# Altium schematic sheet Power_2.SchDoc
size A4; Organization: Altium Limited; Address1: L3, 12a Rodborough Rd; Address2: Frenchs Forest; Address3: NSW; Address4: Australia 2086
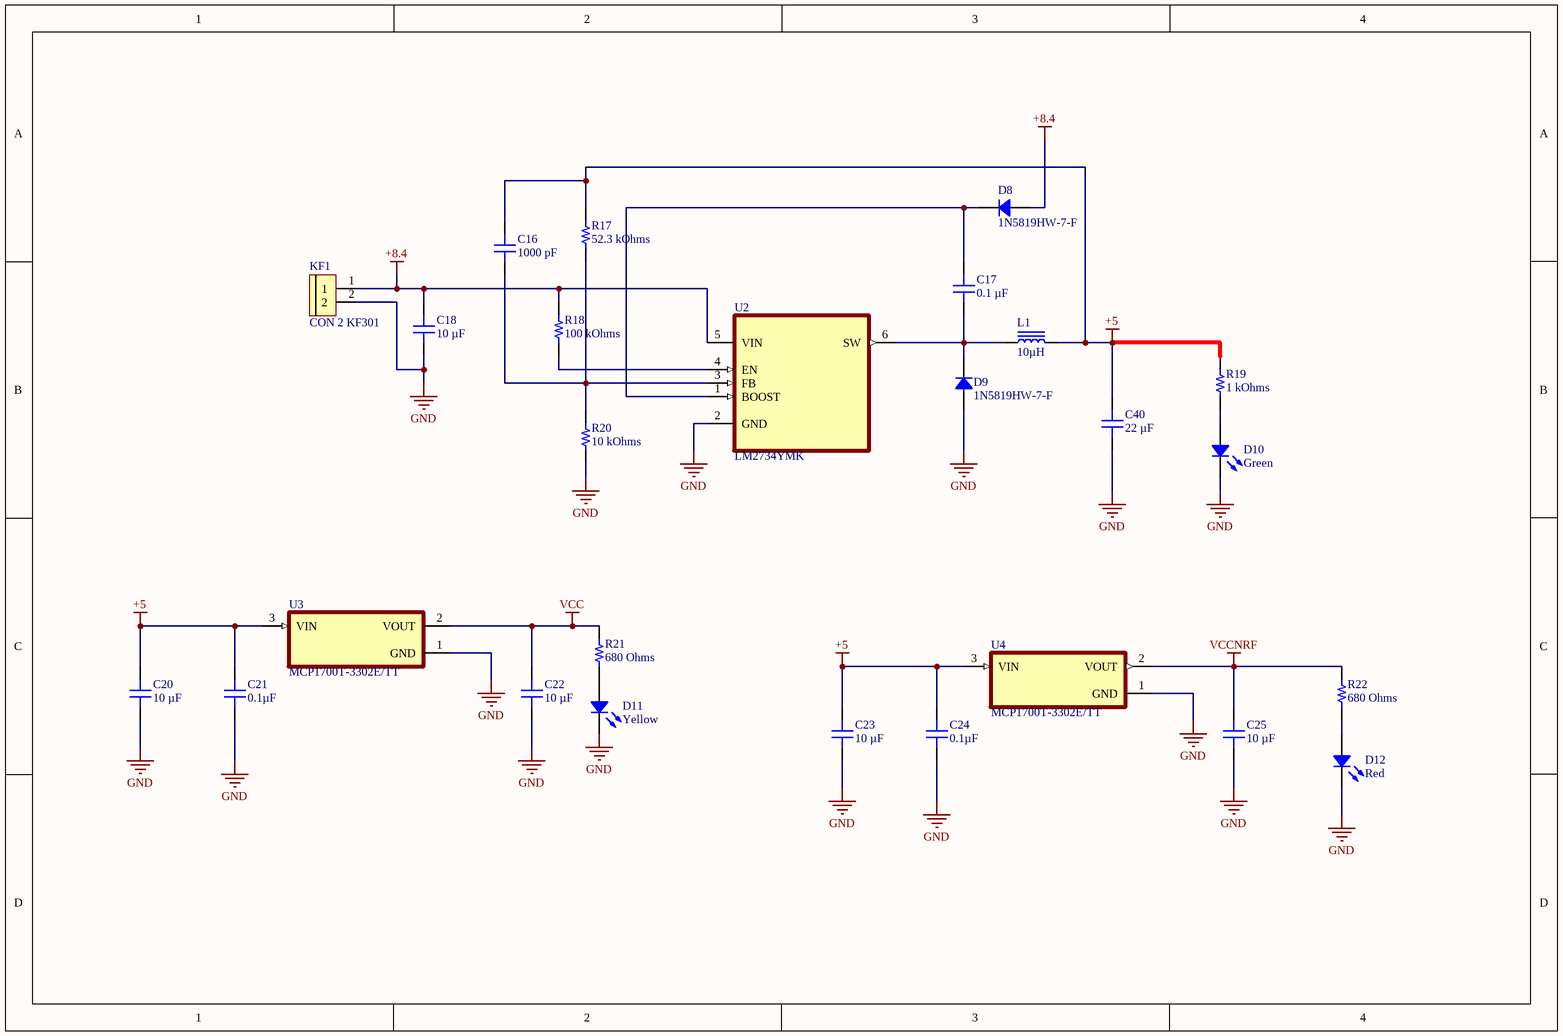
[diagram p0: Power_2.SchDoc]

## Parts
C16  1000 pF  [CAP 0603_1608]
C17  0.1 µF  [CAP 0603_1608]
C18  10 µF  [CAP 0805_2012]
C20  10 µF  [CAP 0805_2012]
C21  0.1µF  [CAP 0603_1608]
C22  10 µF  [CAP 0603_1608]
C23  10 µF  [CAP 0805_2012]
C24  0.1µF  [CAP 0603_1608]
C25  10 µF  [CAP 0603_1608]
C40  22 µF  [CAP 0805_2012]
D8  1N5819HW-7-F  [SOD-123]
D9  1N5819HW-7-F  [SOD-123]
D10  Green  [LED 0603_1608 GREEN]
D11  Yellow  [LED 0603_1608 YELLOW]
D12  Red  [LED 0603_1608 RED]
KF1  CON 2 KF301  [Con 2 KF301 5.08]
L1  10µH  [TDK SLF7032]
R17  52.3 kOhms  [RES 0603_1608]
R18  100 kOhms  [RES 0603_1608]
R19  1 kOhms  [RES 0603_1608]
R20  10 kOhms  [RES 0603_1608]
R21  680 Ohms  [RES 0603_1608]
R22  680 Ohms  [RES 0603_1608]
U2  LM2734YMK  [SOT95P285X100-6N]
U3  MCP1700T-3302E/TT  [SOT95P237X112-3N]
U4  MCP1700T-3302E/TT  [SOT95P237X112-3N]

## Nets
+5: C16.2 C20.2 C21.2 C23.2 C24.2 C40.2 L1.2 R17.2 R19.2 U3.3(VIN) U4.3(VIN)
+8.4: C18.2 D8.1 KF1.1 R18.2 U2.5(VIN)
GND: C18.1 C20.1 C21.1 C22.1 C23.1 C24.1 C25.1 C40.1 D9.1 D10.2 D11.2 D12.2 KF1.2 R20.1 U2.2(GND) U3.1(GND) U4.1(GND)
VCC: C22.2 R21.2 U3.2(VOUT)
VCCNRF: C25.2 R22.2 U4.2(VOUT)
NetC16_1: C16.1 R17.1 R20.2 U2.3(FB)
NetC17_1: C17.1 D9.2 L1.1 U2.6(SW)
NetC17_2: C17.2 D8.2 U2.1(BOOST)
NetD10_1: D10.1 R19.1
NetD11_1: D11.1 R21.1
NetD12_1: D12.1 R22.1
NetR18_1: R18.1 U2.4(EN)

## Notes on the sheet
- Title
- Size:
- Date:
- A4
- Number:
- Time:
- Revision:
- Sheet
- of
- File:

## Library data of the parts
C16 = VJ0603Y102KXQCW1BC: CAP CER 1000PF 10V X7R 0603; manufacturer: Vishay Vitramon; Tolerance: ±10%; Part Number: VJ0603Y102KXQCW1BC; Value: 1000 pF; Applications: General Purpose; Capacitance: 1000 pF; componentlink1description: Datasheet; componentlink1url: https://www.vishay.com/docs/28548/vjw1bcbascomseries.pdf; componentlink2description: DigiKey Link; componentlink2url: https://www.digikey.com/en/products/detail/vishay-vitramon/VJ0603Y102KXQCW1BC/8305229; Device Package: 0603 (1608 Metric); lastupdated: 2/9/2024 8:10:13 PM; Lifecycle Status: Active; Minimum Order: 1; Mounting Type: Surface Mount, MLCC; Operating Temperature: -55°C ~ 125°C; Package / Case: 0603 (1608 Metric); packaging: TapeAndReel; partid: 14875; Part Status: Active; price: 0.01; series: VJ W1BC; Size / Dimension: 0.063" L x 0.031" W (1.60mm x 0.80mm); Supplier 1: DigiKey; Supplier Part Number 1: 720-1679-1-ND; Temperature Coefficient: X7R; Thickness (Max): 0.034" (0.87mm); Voltage - Rated: 10V
C17 = CX0603MRX7R6BB104: CAP CER 0.1UF 10V X7R 0603; manufacturer: PulseLarsen Antennas; Tolerance: ±20%; Part Number: CX0603MRX7R6BB104; Value: 0.1 µF; Applications: Bypass, Decoupling; Capacitance: 0.1 µF; componentlink1description: Datasheet; componentlink1url: https://productfinder.pulseelectronics.com/api/open/product-attachments/datasheet/cx0805mrx7r0bb102; componentlink2description: DigiKey Link; componentlink2url: https://www.digikey.com/en/products/detail/pulselarsen-antennas/CX0603MRX7R6BB104/1219074; Device Package: 0603 (1608 Metric); Features: Low ESL (X2Y); lastupdated: 2/9/2024 8:09:55 PM; Lifecycle Status: Active; Minimum Order: 1; Mounting Type: Surface Mount, MLCC; Operating Temperature: -55°C ~ 125°C; Package / Case: 0603 (1608 Metric); packaging: TapeAndReel; partid: 34696; Part Status: Active; price: 0.09; series: X2Y®; Size / Dimension: 0.063" L x 0.033" W (1.60mm x 0.85mm); Supplier 1: DigiKey; Supplier Part Number 1: 311-1237-1-ND; Temperature Coefficient: X7R; Thickness (Max): 0.030" (0.75mm); Voltage - Rated: 10V
C18 = CL21A106KOQNNWE: CAP CER 10UF 16V X5R 0805; manufacturer: Samsung Electro-Mechanics; Tolerance: ±10%; Part Number: CL21A106KOQNNWE; Value: 10 µF; Applications: General Purpose; Capacitance: 10 µF; componentlink1description: Datasheet; componentlink1url: http://www.samsungsem.com/kr/support/product-search/mlcc/CL21A106KOQNNWE.jsp; componentlink2description: DigiKey Link; componentlink2url: https://www.digikey.com/en/products/detail/samsung-electro-mechanics/CL21A106KOQNNWE/3888552; Device Package: 0805 (2012 Metric); lastupdated: 2/9/2024 8:15:45 PM; Lifecycle Status: Active; Minimum Order: 1; Mounting Type: Surface Mount, MLCC; Operating Temperature: -55°C ~ 85°C; Package / Case: 0805 (2012 Metric); packaging: TapeAndReel; partid: 11753; Part Status: Active; price: 0.02; series: CL; Size / Dimension: 0.079" L x 0.049" W (2.00mm x 1.25mm); Supplier 1: DigiKey; Supplier Part Number 1: 1276-2894-1-ND; Temperature Coefficient: X5R; Thickness (Max): 0.055" (1.40mm); Voltage - Rated: 16V
C20 C23 = CL21A106KOQNNNG: CAP CER 10UF 16V X5R 0805; manufacturer: Samsung Electro-Mechanics; Tolerance: ±10%; Part Number: CL21A106KOQNNNG; Value: 10 µF; Applications: General Purpose; Capacitance: 10 µF; componentlink1description: Datasheet; componentlink1url: http://www.samsungsem.com/kr/support/product-search/mlcc/CL21A106KOQNNNG.jsp; componentlink2description: DigiKey Link; componentlink2url: https://www.digikey.com/en/products/detail/samsung-electro-mechanics/CL21A106KOQNNNG/3894417; Device Package: 0805 (2012 Metric); lastupdated: 2/9/2024 8:15:59 PM; Lifecycle Status: Active; Minimum Order: 1; Mounting Type: Surface Mount, MLCC; Operating Temperature: -55°C ~ 85°C; Package / Case: 0805 (2012 Metric); packaging: TapeAndReel; partid: 39874; Part Status: Active; price: 0.01; series: CL; Size / Dimension: 0.079" L x 0.049" W (2.00mm x 1.25mm); Supplier 1: DigiKey; Supplier Part Number 1: 1276-6455-1-ND; Temperature Coefficient: X5R; Thickness (Max): 0.055" (1.40mm); Voltage - Rated: 16V
C21 = LD03ZC104KAB2A: CAP CER 0.1UF 10V X7R 0603; manufacturer: AVX Corporation; Tolerance: ±10%; Part Number: LD03ZC104KAB2A; Value: 0.1µF; Applications: General Purpose; Capacitance: 0.1µF; componentlink1description: Datasheet; componentlink1url: http://datasheets.avx.com/LD-Series.pdf; componentlink2description: DigiKey Link; componentlink2url: http://digikey.com/product-detail/en/avx-corporation/LD03ZC104KAB2A/478-12926-1-ND/9949296; Device Package: 0603 (1608 Metric); lastupdated: 9/2/2020 1:03:06 AM; Lifecycle Status: Active; Minimum Order: 1; Mounting Type: Surface Mount, MLCC; Operating Temperature: -55°C ~ 125°C; Package / Case: 0603 (1608 Metric); packaging: TapeAndReel; partid: 16481; Part Status: Active; price: 0.17; series: LD; Size / Dimension: 0.063" L x 0.032" W (1.60mm x 0.81mm); Supplier 1: DigiKey; Supplier Part Number 1: 478-12926-1-ND; Temperature Coefficient: X7R; Thickness (Max): 0.035" (0.90mm); Voltage - Rated: 10V
C22 C25 = KGM15CS61A106MT: CAP CER 10UF 10V X6S 0603; manufacturer: KYOCERA AVX; Tolerance: ±20%; Part Number: KGM15CS61A106MT; Value: 10 µF; Applications: General Purpose; Capacitance: 10 µF; componentlink1description: Datasheet; componentlink1url: https://ele.kyocera.com/assets/products/capacitor/CM_Series_e.pdf; componentlink2description: DigiKey Link; componentlink2url: https://www.digikey.com/en/products/detail/kyocera-avx/KGM15CS61A106MT/12397342; Device Package: 0603 (1608 Metric); lastupdated: 2/9/2024 8:09:23 PM; Lifecycle Status: Active; Minimum Order: 1; Mounting Type: Surface Mount, MLCC; Operating Temperature: -55°C ~ 105°C; Package / Case: 0603 (1608 Metric); packaging: TapeAndReel; partid: 51317; Part Status: Active; price: 0.04; series: KGM - X6S; Size / Dimension: 0.063" L x 0.031" W (1.60mm x 0.80mm); Supplier 1: DigiKey; Supplier Part Number 1: 478-KGM15CS61A106MTCT-ND; Temperature Coefficient: X6S; Thickness (Max): 0.039" (1.00mm); Voltage - Rated: 10V
C24 = 0603YC104JAZ2A: CAP CER 0.1UF 16V X7R 0603; manufacturer: AVX Corporation; Tolerance: ±5%; Part Number: 0603YC104JAZ2A; Value: 0.1µF; Applications: Boardflex Sensitive; Capacitance: 0.1µF; componentlink1description: Datasheet; componentlink1url: http://datasheets.avx.com/FlexitermMLCC.pdf; componentlink2description: DigiKey Link; componentlink2url: http://digikey.com/product-detail/en/avx-corporation/0603YC104JAZ2A/478-5291-1-ND/1950958; Device Package: 0603 (1608 Metric); Features: Soft Termination; lastupdated: 9/2/2020 1:03:16 AM; Lifecycle Status: Active; Minimum Order: 1; Mounting Type: Surface Mount, MLCC; Operating Temperature: -55°C ~ 125°C; Package / Case: 0603 (1608 Metric); packaging: TapeAndReel; partid: 13201; Part Status: Active; price: 0.11; series: FLEXITERM®; Size / Dimension: 0.063" L x 0.032" W (1.60mm x 0.81mm); Supplier 1: DigiKey; Supplier Part Number 1: 478-5291-1-ND; Temperature Coefficient: X7R; Thickness (Max): 0.035" (0.90mm); Voltage - Rated: 16V
C40 = C2012X5R1A226M125AE: CAP CER 22UF 10V X5R 0805; manufacturer: TDK Corporation; Tolerance: ±20%; Part Number: C2012X5R1A226M125AE; Value: 22 µF; Applications: Boardflex Sensitive; Capacitance: 22 µF; componentlink1description: Datasheet; componentlink1url: https://product.tdk.com/info/en/catalog/datasheets/mlcc_commercial_soft_en.pdf?ref_disty=digikey; componentlink2description: DigiKey Link; componentlink2url: https://www.digikey.com/en/products/detail/tdk-corporation/C2012X5R1A226M125AE/9991384; Device Package: 0805 (2012 Metric); Features: Soft Termination; lastupdated: 2/9/2024 8:15:35 PM; Lifecycle Status: Active; Minimum Order: 1; Mounting Type: Surface Mount, MLCC; Operating Temperature: -55°C ~ 85°C; Package / Case: 0805 (2012 Metric); packaging: TapeAndReel; partid: 39859; Part Status: Active; price: 0.36; series: C; Size / Dimension: 0.079" L x 0.049" W (2.00mm x 1.25mm); Supplier 1: DigiKey; Supplier Part Number 1: 445-C2012X5R1A226M125AECT-ND; Temperature Coefficient: X5R; Thickness (Max): 0.059" (1.50mm); Voltage - Rated: 10V
D8 D9 = 1N5819HW-7-F: DIODE SCHOTTKY 40V 1A SOD123; Manufacturer: Diodes Incorporated; Capacitance @ Vr, F: 60pF @ 4V, 1MHz; Current - Reverse Leakage @ Vr: 1 mA @ 40 V; Speed: Fast Recovery =< 500ns, > 200mA (Io); Voltage - Forward (Vf) (Max) @ If: 450 mV @ 1 A; Part Number: 1N5819HW-7-F; ComponentLink1Description: Datasheet; ComponentLink1URL: https://www.diodes.com/assets/Datasheets/ds30217.pdf; ComponentLink2Description: DigiKey Link; ComponentLink2URL: https://www.digikey.com/en/products/detail/diodes-incorporated/1N5819HW-7-F/814970; Current - Average Rectified (Io): 1A; Diode Type: Schottky; LastUpdated: 6/3/2024 7:54:46 PM; Lifecycle Status: Active; Minimum Order: 1; Mounting Type: Surface Mount; Operating Temperature - Junction: -65°C ~ 125°C; Package / Case: SOD-123; Packaging: TapeAndReel; PartId: 2212; Part Status: Active; Price: 0.05; Series: -; Supplier 1: DigiKey; Supplier Part Number 1: 1N5819HW-FDICT-ND; Supplier Device Package: SOD-123; Voltage - DC Reverse (Vr) (Max): 40 V
D10 = QBLP601-IG: LED GREEN CLEAR 0603 SMD; Manufacturer: QT Brightek (QTB); Configuration: Standard; Current - Test: 20mA; Lens Color: Colorless; Lens Size: 1.10mm x 0.80mm; Lens Style: Rectangle with Flat Top; Millicandela Rating: 450mcd; Viewing Angle: 140°; Voltage - Forward (Vf) (Typ): 3.2V; Wavelength - Dominant: 525nm; Part Number: QBLP601-IG; Color: Green; ComponentLink1Description: Datasheet; ComponentLink1URL: http://www.qt-brightek.com/datasheet/QBLP601_series.pdf; ComponentLink2Description: DigiKey Link; ComponentLink2URL: https://www.digikey.com/en/products/detail/qt-brightek-qtb/QBLP601-IG/4814653; Device Package: 0603 (1608 Metric); Height (Max): 0.60mm; LastUpdated: 6/3/2024 7:58:52 PM; Lens Transparency: Clear; Lifecycle Status: Active; Minimum Order: 1; Mounting Type: Surface Mount; Package / Case: 0603 (1608 Metric); Packaging: TapeAndReel; PartId: 668; Part Status: Active; Price: 0.06; Series: QBLP601; Size / Dimension: 1.60mm L x 0.80mm W; Supplier 1: DigiKey; Supplier Part Number 1: 1516-1055-1-ND; Supplier Device Package: 0603; Value: Green
D11 = VAOL-S6YP4: LED YELLOW CLEAR 0603 SMD; Manufacturer: Visual Communications Company - VCC; Configuration: Standard; Current - Test: 10mA; Lens Color: Colorless; Lens Size: 1.20mm x 0.80mm; Lens Style: Rectangle with Flat Top; Millicandela Rating: 33mcd; Viewing Angle: 120°; Voltage - Forward (Vf) (Typ): 1.9V; Wavelength - Dominant: 591nm; Part Number: VAOL-S6YP4; Color: Yellow; ComponentLink1Description: Datasheet; ComponentLink1URL: http://vcclite.com/_pdf/VAOL-S6YP4-LED-0603-yellow.pdf; ComponentLink2Description: DigiKey Link; ComponentLink2URL: http://digikey.com/product-detail/en/visual-communications-company-vcc/VAOL-S6YP4/VAOL-S6YP4CT-ND/5176154; Device Package: 0603 (1608 Metric); Height (Max): 0.60mm; LastUpdated: 6/3/2024 8:01:09 PM; Lens Transparency: Clear; Lifecycle Status: Active; Minimum Order: 1; Mounting Type: Surface Mount; Package / Case: 0603 (1608 Metric); Packaging: TapeAndReel; PartId: 153; Part Status: Active; Price: 0.09; Series: -; Size / Dimension: 1.60mm L x 0.80mm W; Supplier 1: DigiKey; Supplier Part Number 1: VAOL-S6YP4CT-ND; Supplier Device Package: 0603; Value: Yellow; Wavelength - Peak: 591nm
D12 = B18W1URO-20C000114U1930: LED RED CLEAR 0603 SMD; Manufacturer: Harvatek Corporation; Current - Test: 20mA; Lens Color: Colorless; Lens Size: 0.80mm Dia; Lens Style: Round with Flat Top; Millicandela Rating: 360mcd; Viewing Angle: 55°; Voltage - Forward (Vf) (Typ): 2.1V; Wavelength - Dominant: 630nm; Wavelength - Peak: 639nm; Part Number: B18W1URO-20C000114U1930; Color: Red; ComponentLink1Description: Datasheet; ComponentLink1URL: https://media.digikey.com/pdf/Data%20Sheets/Harvatek%20PDFs/B18W1URO-20C000114U1930.pdf; ComponentLink2Description: DigiKey Link; ComponentLink2URL: https://www.digikey.com/en/products/detail/harvatek-corporation/B18W1URO-20C000114U1930/16671735; Device Package: 0603 (1608 Metric); Height (Max): 1.05mm; LastUpdated: 6/3/2024 7:59:44 PM; Lens Transparency: Clear; Lifecycle Status: Active; Minimum Order: 1; Mounting Type: Surface Mount; Package / Case: 0603 (1608 Metric); Packaging: TapeAndReel; PartId: 1174; Part Status: Active; Price: 0.16; Series: B18W1URO; Size / Dimension: 1.60mm L x 0.80mm W; Supplier 1: DigiKey; Supplier Part Number 1: 3147-B18W1URO-20C000114U1930CT-ND; Supplier Device Package: 0603; Value: Red
KF1 = CON 2 KF301: Cắm; Ma_Hang: MH000987; Ten_Linh_Kien: CON 2 KF301-2P 5.08MM Xanh Dương; Chung_Loai: Cắm; Ghi_Chu: *; Kieu_Chan: *; Don_Vi: Con
L1 = SLF7032T-100M1R4-2PF: FIXED IND 10UH 1.4A 63.6 MOHM; Manufacturer: TDK Corporation; DC Resistance (DCR): 63.6mOhm Max; Inductance Frequency - Test: 100kHz; Material - Core: Ferrite; Shielding: Shielded; Tolerance: ±20%; Type: Wirewound; Part Number: SLF7032T-100M1R4-2PF; ComponentLink1Description: Datasheet; ComponentLink1URL: //media.digikey.com/pdf/Data%20Sheets/TDK%20PDFs/SLF7032_Type.pdf; ComponentLink2Description: DigiKey Link; ComponentLink2URL: http://digikey.com/product-detail/en/tdk-corporation/SLF7032T-100M1R4-2PF/445-1998-1-ND/755405; Current Rating (Amps): 1.4A; Device Package: Nonstandard; Height - Seated (Max): 0.134" (3.40mm); Inductance: 10µH; LastUpdated: 9/2/2020 1:30:24 AM; Lifecycle Status: Active; Minimum Order: 1; Mounting Type: Surface Mount; Operating Temperature: -40°C ~ 105°C; Package / Case: Nonstandard; Packaging: TapeAndReel; PartId: 3677; Part Status: Active; Price: 0.43; Series: SLF; Size / Dimension: 0.276" L x 0.276" W (7.00mm x 7.00mm); Supplier 1: DigiKey; Supplier Part Number 1: 445-1998-1-ND; Value: 10µH
R17 = RMEF0603FT52K3: RES 52.3K OHM 1% 1/10W 0603; Manufacturer: Stackpole Electronics Inc; Power (Watts): 0.1W, 1/10W; Ratings: 7C1 RoHS w/out Exemption (100% Pb-Free), AEC-Q200; Temperature Coefficient: ±100ppm/°C; Part Number: RMEF0603FT52K3; Value: 52.3 kOhms; ComponentLink1Description: Datasheet; ComponentLink1URL: https://www.seielect.com/Catalog/SEI-RMEF.pdf; ComponentLink2Description: DigiKey Link; ComponentLink2URL: https://www.digikey.com/en/products/detail/stackpole-electronics-inc/RMEF0603FT52K3/16839815; Composition: Thick Film; Device Package: 0603 (1608 Metric); Features: Automotive AEC-Q200; Height - Seated (Max): 0.020" (0.50mm); LastUpdated: 2/9/2024 8:41:04 PM; Lifecycle Status: Active; Minimum Order: 1; Number of Terminations: 2; Operating Temperature: -55°C ~ 155°C; Package / Case: 0603 (1608 Metric); Packaging: TapeAndReel; PartId: 69499; Part Status: Active; Price: 0.01; Resistance: 52.3 kOhms; Series: RMEF; Size / Dimension: 0.063" L x 0.031" W (1.60mm x 0.80mm); Supplier 1: DigiKey; Supplier Part Number 1: 738-RMEF0603FT52K3CT-ND; Supplier Device Package: 0603; Tolerance: ±1%
R18 = TNPW0603100KBXEN: RES 100K OHM 0.1% 1/10W 0603; Manufacturer: Vishay Dale; Power (Watts): 0.1W, 1/10W; Temperature Coefficient: ±15ppm/°C; Part Number: TNPW0603100KBXEN; Value: 100 kOhms; ComponentLink1Description: Datasheet; ComponentLink1URL: http://www.vishay.com/docs/28758/tnpw_e3.pdf; ComponentLink2Description: DigiKey Link; ComponentLink2URL: https://www.digikey.com/en/products/detail/vishay-dale/TNPW0603100KBXEN/4155839; Composition: Thin Film; Device Package: 0603 (1608 Metric); Features: Anti-Sulfur, Automotive AEC-Q200, Moisture Resistant; Height - Seated (Max): 0.022" (0.55mm); LastUpdated: 2/9/2024 8:42:03 PM; Lifecycle Status: Active; Minimum Order: 1; Number of Terminations: 2; Operating Temperature: -55°C ~ 155°C; Package / Case: 0603 (1608 Metric); Packaging: TapeAndReel; PartId: 25339; Part Status: Active; Price: 0.31; Ratings: AEC-Q200; Resistance: 100 kOhms; Series: TNPW e3; Size / Dimension: 0.063" L x 0.033" W (1.60mm x 0.85mm); Supplier 1: DigiKey; Supplier Part Number 1: 541-1721-1-ND; Supplier Device Package: 0603; Tolerance: ±0.1%
R19 = RG1608V-102-B-T5: RES SMD 1K OHM 0.1% 1/10W 0603; Manufacturer: Susumu; Power (Watts): 0.1W, 1/10W; Temperature Coefficient: ±5ppm/°C; Part Number: RG1608V-102-B-T5; Value: 1 kOhms; ComponentLink1Description: Datasheet; ComponentLink1URL: https://www.susumu.co.jp/common/pdf/n_catalog_partition01_en.pdf; ComponentLink2Description: DigiKey Link; ComponentLink2URL: https://www.digikey.com/en/products/detail/susumu/RG1608V-102-B-T5/1258937; Composition: Thin Film; Device Package: 0603 (1608 Metric); Features: Anti-Sulfur, Automotive AEC-Q200; Height - Seated (Max): 0.020" (0.50mm); LastUpdated: 2/9/2024 8:40:32 PM; Lifecycle Status: Active; Minimum Order: 1; Number of Terminations: 2; Operating Temperature: -55°C ~ 155°C; Package / Case: 0603 (1608 Metric); Packaging: TapeAndReel; PartId: 82062; Price: 0.78; Ratings: AEC-Q200; Resistance: 1 kOhms; Series: RG; Size / Dimension: 0.063" L x 0.031" W (1.60mm x 0.80mm); Supplier 1: DigiKey; Supplier Part Number 1: 408-RG1608V-102-B-T5CT-ND; Supplier Device Package: 0603; Tolerance: ±0.1%
R20 = CPF-A-0603B10KE1: RES SMD 10K OHM 0.1% 1/16W 0603; Manufacturer: TE Connectivity Passive Product; Power (Watts): 0.063W, 1/16W; Temperature Coefficient: ±25ppm/°C; Part Number: CPF-A-0603B10KE1; Value: 10 kOhms; ComponentLink1Description: Datasheet; ComponentLink1URL: https://www.te.com/commerce/DocumentDelivery/DDEController?Action=srchrtrv&DocNm=1773200-1&DocType=DS&DocLang=English; ComponentLink2Description: DigiKey Link; ComponentLink2URL: https://www.digikey.com/en/products/detail/te-connectivity-passive-product/CPF-A-0603B10KE1/5586834; Composition: Thin Film; Device Package: 0603 (1608 Metric); Features: Anti-Sulfur, Automotive AEC-Q200, Moisture Resistant; Height - Seated (Max): 0.022" (0.55mm); LastUpdated: 2/9/2024 8:40:47 PM; Lifecycle Status: Active; Minimum Order: 1; Number of Terminations: 2; Operating Temperature: -55°C ~ 155°C; Package / Case: 0603 (1608 Metric); Packaging: TapeAndReel; PartId: 75468; Part Status: Active; Price: 0.12; Ratings: AEC-Q200; Resistance: 10 kOhms; Series: CPF-A, Neohm; Size / Dimension: 0.061" L x 0.031" W (1.55mm x 0.80mm); Supplier 1: DigiKey; Supplier Part Number 1: 1712-CPF-A-0603B10KE1CT-ND; Supplier Device Package: 0603; Tolerance: ±0.1%
R21 R22 = CPF-A-0603B680RE: RES SMD 680 OHM 0.1% 1/16W 0603; Manufacturer: TE Connectivity Passive Product; Power (Watts): 0.063W, 1/16W; Temperature Coefficient: ±25ppm/°C; Part Number: CPF-A-0603B680RE; Value: 680 Ohms; ComponentLink1Description: Datasheet; ComponentLink1URL: https://www.te.com/commerce/DocumentDelivery/DDEController?Action=srchrtrv&DocNm=1773200-1&DocType=DS&DocLang=English; ComponentLink2Description: DigiKey Link; ComponentLink2URL: https://www.digikey.com/en/products/detail/te-connectivity-passive-product/CPF-A-0603B680RE/5583848; Composition: Thin Film; Device Package: 0603 (1608 Metric); Features: Anti-Sulfur, Automotive AEC-Q200, Moisture Resistant; Height - Seated (Max): 0.022" (0.55mm); LastUpdated: 2/9/2024 8:42:04 PM; Lifecycle Status: Active; Minimum Order: 1; Number of Terminations: 2; Operating Temperature: -55°C ~ 155°C; Package / Case: 0603 (1608 Metric); Packaging: TapeAndReel; PartId: 25303; Part Status: Active; Price: 0.09; Ratings: AEC-Q200; Resistance: 680 Ohms; Series: CPF-A, Neohm; Size / Dimension: 0.061" L x 0.031" W (1.55mm x 0.80mm); Supplier 1: DigiKey; Supplier Part Number 1: 1712-CPF-A-0603B680RECT-ND; Supplier Device Package: 0603; Tolerance: ±0.1%
U2 = LM2734YMK: Buck Switching Regulator IC Positive Adjustable 0.8V 1 Output 1A SOT-23-6 Thin, TSOT-23-6; MF: Texas Instruments; SnapEDA_Link: https://www.snapeda.com/parts/LM2734YMK/Texas%20Instruments/view-part/105783/?ref=snap; Price: None; Availability: Unavailable; Package: SOT-23 Texas Instruments; MP: LM2734YMK; Value: *
U3 U4 = MCP1700T-3302E/TT: Linear Voltage Regulator IC 1 Output 250mA SOT-23-3; MF: Microchip; Availability: Unavailable; Value: *; Package: SOT-23-3 Microchip; Price: None; MP: MCP1700T-3302E/TT; SnapEDA_Link: https://www.snapeda.com/parts/MCP1700T-3302E/TT/Microchip/view-part/50877/?ref=snap